# Altium schematic sheet 555-schematic.SchDoc
size A4; SheetNumber: 1; SheetTotal: 1
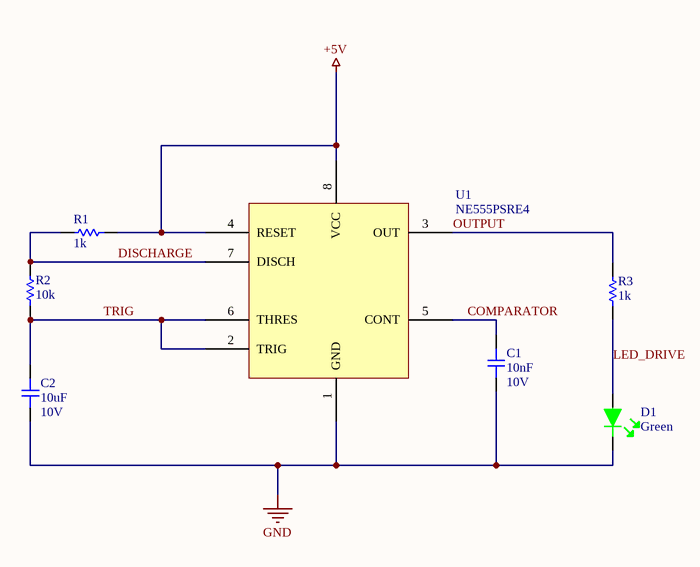
[diagram p0: 555-schematic.SchDoc]

## Parts
C1  10nF  Voltage Rating (DC): 10V  [C603]
C2  10uF  Voltage: 10V  [C603]
D1  Green  [LED_0603]
R1  1k  [R0603]
R2  10k  [R0603]
R3  1k  [R0603]
U1  NE555PSRE4  [SOIC-8]

## Nets
+5V: R1.1 U1.4(RESET) U1.8(VCC)
GND: C1.1 C2.1 D1.2 U1.1(GND)
COMPARATOR: C1.2 U1.5(CONT)
DISCHARGE: R1.2 R2.2 U1.7(DISCH)
LED_DRIVE: D1.1 R3.1
OUTPUT: R3.2 U1.3(OUT)
TRIG: C2.2 R2.1 U1.2(TRIG) U1.6(THRES)

## Library data of the parts
C1 = CC0603KRX7R6BB103: Cap Ceramic 0.01uF 10V X7R 10% SMD 0603 125C Paper T/R; Manufacturer: Yageo; Supplier 1: Digi-Key; Manufacturer Part Number: CC0603KRX7R6BB103; RoHS: Yes; Category: Ceramic Capacitors; Stock 1: 8229; Pricing 1: 1=0.10000, 10=0.05500, 50=0.02980, 100=0.02430, 500=0.01738, 1000=0.01366 (USD); Mount: Surface Mount; Case/Package: 0603; Min Operating Temperature: -55°C; Max Operating Temperature: 125°C; Capacitance: 10nF; Tolerance: 10%; Packaging: Tape and Reel; Dielectric: X7R; Resistor Type: Ceramic; Voltage Rating: 10V; Series: CC; Construction: Flat; Length: 0.063inch; Width: 0.031inch; Height: 0.8mm; Thickness: 0.035inch; Depth: 0.8mm; Radiation Hardening: No; Lead Free: Lead Free; Halogen Free: Halogen Free; RoHS Compliant: Yes; ComponentLink1URL: https://datasheet.ciiva.com/11586/upy-gphc-x7r-6-3v-to-50v-8-11586326.pdf?src-supplier=Avnet; ComponentLink1Description: https://datasheet.ciiva.com/11586/upy-gphc-x7r-6-3v-to-50v-8-11586326.pdf?src-supplier=Avnet; ComponentLink2URL: https://datasheet.ciiva.com/17434/upy-gphc-x7r-6-3v-to-50v-8-17434572.pdf?src-supplier=Avnet+Europe; ComponentLink2Description: https://datasheet.ciiva.com/17434/upy-gphc-x7r-6-3v-to-50v-8-17434572.pdf?src-supplier=Avnet+Europe; Supplier Part Number 1: 311-4054-1-ND
C2 = GRM21BC81A106KE18L: CAPACITOR, 0805, X6S, 10V, 10UF; Manufacturer: Murata; Material: Ceramic; Tolerance: 10%; Supplier 1: Digi-Key; Manufacturer Part Number: GRM21BC81A106KE18L; RoHS: Yes; Category: Ceramic Capacitors; Stock 1: 10862; Pricing 1: 1=0.26000, 10=0.17800, 50=0.11860, 100=0.10090, 500=0.07120, 1000=0.06231 (USD); Mount: Surface Mount; Case/Package: 0805; Case Code (Metric): 2012; Case Code (Imperial): 0805; Min Operating Temperature: -55°C; Max Operating Temperature: 105°C; Capacitance: 10uF; Voltage Rating: 10V; Packaging: Tape and Reel; Package Quantity: 3000; Voltage Rating (DC): 10V; Dielectric: X6S; Termination: SMD/SMT; Series: GRM; Construction: Flat; Length: 2mm; Width: 1.25mm; Height: 1.25mm; Thickness: 0.053inch; Depth: 1.25mm; Radiation Hardening: No; REACH SVHC: No SVHC; Lead Free: Lead Free; RoHS Compliant: Yes; ComponentLink1URL: https://datasheet.ciiva.com/11607/product-11607527.pdf?src-supplier=Avnet; ComponentLink1Description: https://datasheet.ciiva.com/11607/product-11607527.pdf?src-supplier=Avnet; ComponentLink2URL: https://datasheet.ciiva.com/25613/0900766b81023a1e-25613080.pdf?src-supplier=RSComponents; ComponentLink2Description: https://datasheet.ciiva.com/25613/0900766b81023a1e-25613080.pdf?src-supplier=RSComponents; ComponentLink3URL: https://datasheet.ciiva.com/22774/608985-22774383.pdf?src-supplier=Farnell; ComponentLink3Description: https://datasheet.ciiva.com/22774/608985-22774383.pdf?src-supplier=Farnell; ComponentLink4URL: https://datasheet.ciiva.com/6270/partnumbering-e-01-6270411.pdf?src-supplier=Digi-Key; ComponentLink4Description: https://datasheet.ciiva.com/6270/partnumbering-e-01-6270411.pdf?src-supplier=Digi-Key; ComponentLink5URL: https://datasheet.ciiva.com/6270/partnumbering-e-01-6270413.pdf?src-supplier=Digi-Key; ComponentLink5Description: https://datasheet.ciiva.com/6270/partnumbering-e-01-6270413.pdf?src-supplier=Digi-Key; ComponentLink6URL: https://datasheet.ciiva.com/6270/partnumbering-e-01-6270414.pdf?src-supplier=Digi-Key; ComponentLink6Description: https://datasheet.ciiva.com/6270/partnumbering-e-01-6270414.pdf?src-supplier=Digi-Key; ComponentLink7URL: https://datasheet.ciiva.com/5411/product-5411868.pdf?src-supplier=Mouser; ComponentLink7Description: https://datasheet.ciiva.com/5411/product-5411868.pdf?src-supplier=Mouser; ComponentLink8URL: https://datasheet.ciiva.com/7719/608985-7719070.pdf?src-supplier=Element14; ComponentLink8Description: https://datasheet.ciiva.com/7719/608985-7719070.pdf?src-supplier=Element14; Supplier Part Number 1: 490-6466-1-ND
D1 = LTST-C171GKT: Green 0805 130 º Min 5 mcd Typical 12 mcd Water Clear Lens SMT LED; Manufacturer: Vishay Lite-On; Lens Color: Colorless; Viewing Angle: 130°; Lens Style: Diffused,Colorless,Rectangular,Clear; Luminous Intensity: 12mcd; Forward Current: 30mA; Forward Voltage: 2.1V; Power Rating: 100mW; Dominant Wavelength: 569nm; Test Current: 10mA; Number of Elements: 1; Wavelength: 585nm; Reverse Voltage: 5V; Supplier 1: Digi-Key; Manufacturer Part Number: LTST-C171GKT; RoHS: Yes; Category: LEDs; Stock 1: 90000; Pricing 1: 3000=0.04646, 6000=0.04040, 15000=0.03636, 30000=0.03232, 75000=0.02929 (USD); Mount: Surface Mount; Case/Package: 0805; Number of Pins: 2; Color: Green; Case Code (Metric): 2012; Case Code (Imperial): 0805; Min Operating Temperature: -55°C; Max Operating Temperature: 85°C; Package Quantity: 1; Packaging: Tape and Reel; Illumination Color: Green; Lens Transparency: Clear; Power Dissipation: 100mW; Number of LEDs: 1; Series: CHIPLED 0805; Length: 2mm; Width: 1.25mm; Height: 0.8mm; Depth: 1.25mm; Radiation Hardening: No; Lead Free: Lead Free; RoHS Compliant: Yes; ComponentLink1URL: https://datasheet.ciiva.com/12400/lite-on-ltst-c171gkt-190133-12400647.pdf?src-supplier=Mouser; ComponentLink1Description: https://datasheet.ciiva.com/12400/lite-on-ltst-c171gkt-190133-12400647.pdf?src-supplier=Mouser; ComponentLink2URL: https://datasheet.ciiva.com/2110/ltst-c171gkt-2110000.pdf?src-supplier=Digi-Key; ComponentLink2Description: https://datasheet.ciiva.com/2110/ltst-c171gkt-2110000.pdf?src-supplier=Digi-Key; ComponentLink3URL: https://datasheet.ciiva.com/11773/0900766b80dc0296-11773991.pdf?src-supplier=RSComponents; ComponentLink3Description: https://datasheet.ciiva.com/11773/0900766b80dc0296-11773991.pdf?src-supplier=RSComponents; ComponentLink4URL: https://datasheet.ciiva.com/2110/ltst-c171gkt-2110001.pdf?src-supplier=Digi-Key; ComponentLink4Description: https://datasheet.ciiva.com/2110/ltst-c171gkt-2110001.pdf?src-supplier=Digi-Key; ComponentLink5URL: https://datasheet.ciiva.com/2110/ltst-c171gkt-2110002.pdf?src-supplier=Digi-Key; ComponentLink5Description: https://datasheet.ciiva.com/2110/ltst-c171gkt-2110002.pdf?src-supplier=Digi-Key; ComponentLink6URL: https://datasheet.ciiva.com/16396/ltst-c171gkt-16396549.pdf?src-supplier=Future+Electronics; ComponentLink6Description: https://datasheet.ciiva.com/16396/ltst-c171gkt-16396549.pdf?src-supplier=Future+Electronics; Supplier Part Number 1: 160-1423-2-ND
R1 R3 = ESR03EZPJ102: ROHM - ESR03EZPJ102 - SMD Chip Resistor, Anti-Surge, 0603 [1608 Metric], 1 kohm, ESR Series, 150 V, Thick Film, 250 mW; Resistance: 1kR; Tolerance: 5%; Temperature Coefficient: 200ppm/°C; Max Power Dissipation: 250mW; Supplier 1: Digi-Key; Manufacturer: Rohm; Manufacturer Part Number: ESR03EZPJ102; RoHS: Yes; Category: Chip SMD Resistors; Stock 1: 247531; Pricing 1: 1=0.10000, 10=0.08200, 100=0.03160, 1000=0.01392, 2500=0.01202 (USD); Case/Package: 0603; Case Code (Metric): 1608; Case Code (Imperial): 0603; Min Operating Temperature: -55°C; Max Operating Temperature: 155°C; Package Quantity: 1; Packaging: Tape and Reel; Resistor Type: Thick Film; Number of Terminations: 2; Series: ESR; Features: Automotive AEC-Q200; Length: 0.063inch; Width: 0.031inch; Height: 0.022inch; Lead Free: Lead Free; RoHS Compliant: Yes; ComponentLink1URL: https://datasheet.ciiva.com/2469/esr-2469603.pdf?src-supplier=Digi-Key; ComponentLink1Description: https://datasheet.ciiva.com/2469/esr-2469603.pdf?src-supplier=Digi-Key; ComponentLink2URL: https://datasheet.ciiva.com/2469/esr-2469604.pdf?src-supplier=Digi-Key; ComponentLink2Description: https://datasheet.ciiva.com/2469/esr-2469604.pdf?src-supplier=Digi-Key; ComponentLink3URL: https://datasheet.ciiva.com/2469/esr-2469605.pdf?src-supplier=Digi-Key; ComponentLink3Description: https://datasheet.ciiva.com/2469/esr-2469605.pdf?src-supplier=Digi-Key; Supplier Part Number 1: RHM1.0KDCT-ND
R2 = RMCF0603JT10K0: Res Thick Film 0603 10K Ohm 5% 1/10W ±100ppm/°C Molded SMD SMD Paper T/R; Manufacturer: Stackpole Electronics; Power Rating: 100mW; Resistance: 10kR; Supplier 1: Digi-Key; Manufacturer Part Number: RMCF0603JT10K0; RoHS: Yes; Category: Chip SMD Resistors; Stock 1: 587436; Pricing 1: 1=0.10000, 10=0.01500, 100=0.00610, 1000=0.00274, 2500=0.00238 (USD); Mount: Surface Mount; Case/Package: 0603; Case Code (Metric): 1608; Case Code (Imperial): 0603; Contact Plating: Tin,Matte; Size Code: 0603; Min Operating Temperature: -55°C; Max Operating Temperature: 155°C; Tolerance: 5%; Packaging: Tape and Reel; Resistor Type: Thick Film; Number of Terminations: 2; Max Power Dissipation: 100mW; Temperature Coefficient: 100ppm/°C; Features: Automotive AEC-Q200; Series: RMCF; Construction: Rectangular; Length: 1.55mm; Width: 0.031inch; Height: 0.022inch; Depth: 0.8mm; Radiation Hardening: No; Military Standard: Not; Lead Free: Lead Free; ComponentLink1URL: https://datasheet.ciiva.com/15193/getdatasheetpartid-364254-15193501.pdf?src-supplier=Verical; ComponentLink1Description: https://datasheet.ciiva.com/15193/getdatasheetpartid-364254-15193501.pdf?src-supplier=Verical; Supplier Part Number 1: RMCF0603JT10K0CT-ND
U1 = NE555PSRE4: IC OSC SINGLE TIMER 100KHZ 8SO; Manufacturer: Texas Instruments; Min Supply Voltage: 4.5V; Max Supply Voltage: 16V; Nominal Supply Current: 2mA; Operating Supply Current: 10mA; Number of Timers/Counters: 1; Quiescent Current: 15mA; High Level Output Current: -200mA; Low Level Output Current: 200mA; RoHS: Yes; Category: Timers and Oscillators; Stock 1: 755; Pricing 1: 1=0.46000, 10=0.36900, 50=0.36900, 100=0.22800, 1000=0.14200, 10000=0.11300 (USD); Mount: Surface Mount; Case/Package: SOP; Number of Pins: 8; Weight: 0.004325oz; Min Operating Temperature: 0°C; Max Operating Temperature: 70°C; Packaging: Tape and Reel; Package Quantity: 2000; Frequency: 100kHz; Series: NE555; Supply Current: 2mA; Radiation Hardening: No; Lead Free: Lead Free; RoHS Compliant: Yes; ComponentLink1URL: https://datasheet.ciiva.com/15152/getdatasheetpartid-674139-15152742.pdf?src-supplier=Verical; ComponentLink1Description: https://datasheet.ciiva.com/15152/getdatasheetpartid-674139-15152742.pdf?src-supplier=Verical; ComponentLink2URL: https://datasheet.ciiva.com/14273/se555m-14273678.pdf?src-supplier=Avnet; ComponentLink2Description: https://datasheet.ciiva.com/14273/se555m-14273678.pdf?src-supplier=Avnet; ComponentLink3URL: https://datasheet.ciiva.com/1235/ne555-1235925.pdf?src-supplier=Digi-Key; ComponentLink3Description: https://datasheet.ciiva.com/1235/ne555-1235925.pdf?src-supplier=Digi-Key; Supplier Part Number 1: 595-NE555PSRE4; Supplier 1: Mouser; Manufacturer Part Number: NE555PSRE4